# Altium schematic sheet MCU.SchDoc
size A3; SheetNumber: 2; SheetTotal: 4
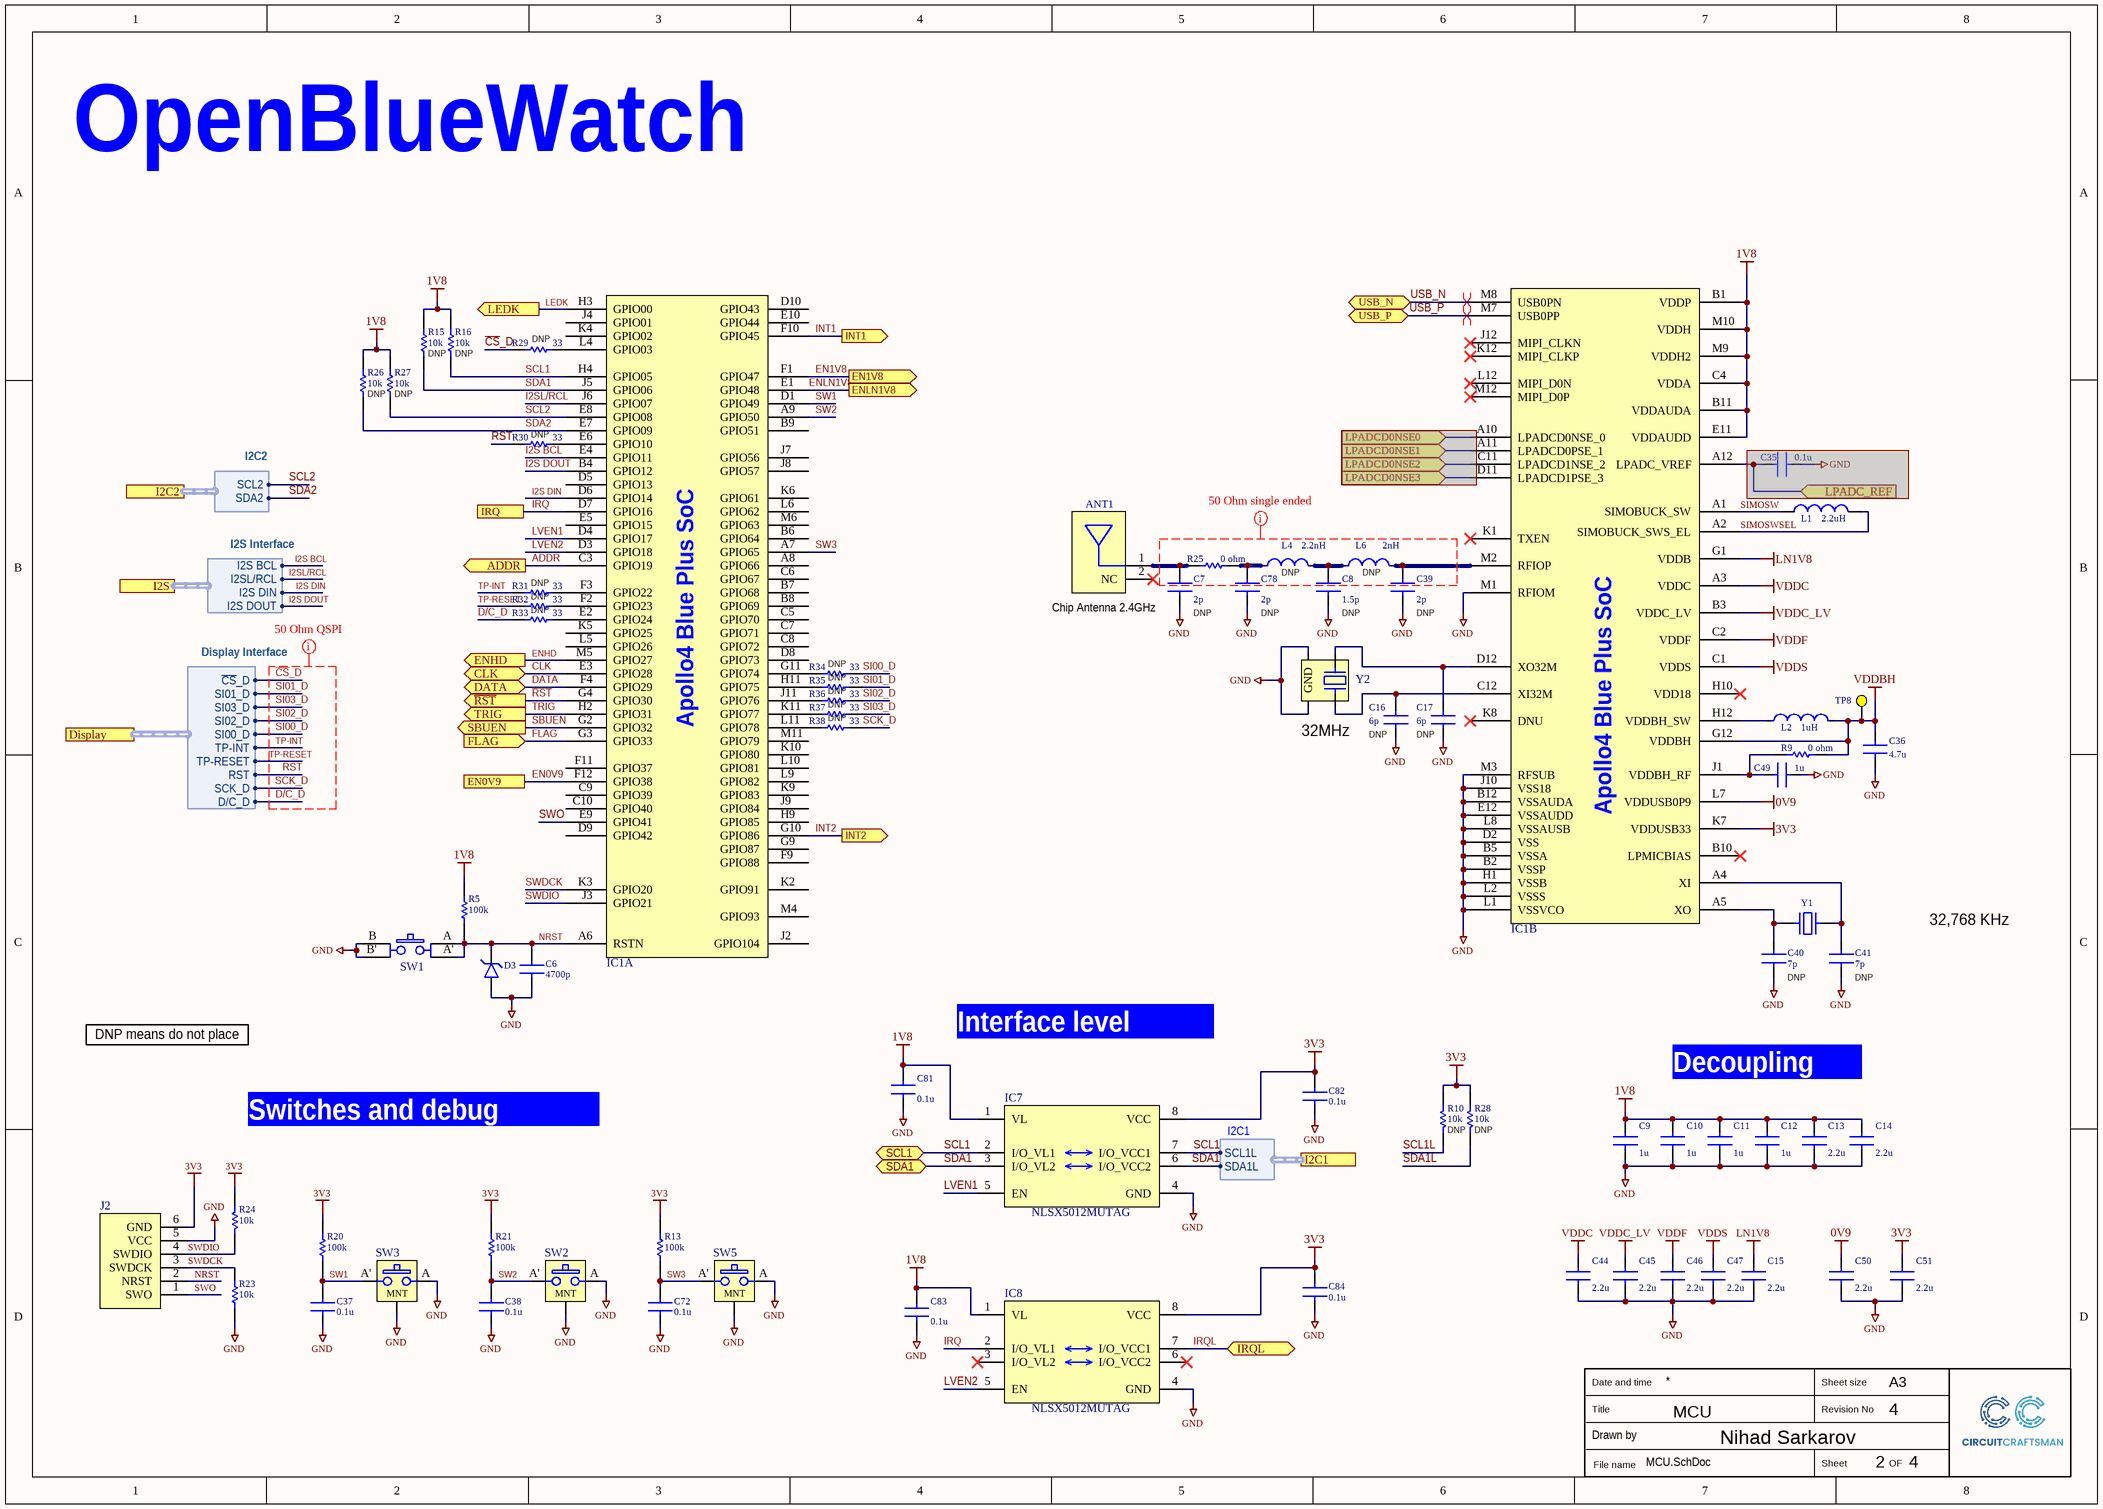
[diagram p0: MCU.SchDoc]

## Parts
ANT1  2450AT18A0100001E  [FP-2450AT18A0100001E-MFG]  (value not drawn)
C6  value 4700p  [FP-CC0201-BA-MFG]  (hidden comment: CC0201KRX7R8BB102)
C7  Capacitance: 2p  [FP-CC0201-BA-MFG]  (hidden comment: CC0201KRX7R8BB102)
C8  Capacitance: 1.5p  [FP-CC0201-BA-MFG]  (hidden comment: CC0201KRX7R8BB102)
C9  value 1u  [FP-CC0402-IPC_C]  (hidden comment: CC0402KRX7R7BB104)
C10  value 1u  [FP-CC0402-IPC_C]  (hidden comment: CC0402KRX7R7BB104)
C11  value 1u  [FP-CC0402-IPC_C]  (hidden comment: CC0402KRX7R7BB104)
C12  value 1u  [FP-CC0402-IPC_C]  (hidden comment: CC0402KRX7R7BB104)
C13  value 2.2u  [FP-CC0402-IPC_C]  (hidden comment: CC0402KRX7R7BB104)
C14  value 2.2u  [FP-CC0402-IPC_C]  (hidden comment: CC0402KRX7R7BB104)
C15  value 2.2u  [FP-CC0402-IPC_C]  (hidden comment: CC0402KRX7R7BB104)
C16  value 6p  [FP-CC0201-BA-MFG]  (hidden comment: CC0201KRX7R8BB102)
C17  value 6p  [FP-CC0201-BA-MFG]  (hidden comment: CC0201KRX7R8BB102)
C35  value 0.1u  [FP-CC0201-BA-MFG]  (hidden comment: CC0201KRX7R8BB102)  (masked out: inside a compile mask, not in the netlist)
C36  value 4.7u  [FP-CC0402-IPC_C]  (hidden comment: CC0402KRX7R7BB104)
C37  value 0.1u  [FP-CC0201-BA-MFG]  (hidden comment: CC0201KRX7R8BB102)
C38  value 0.1u  [FP-CC0201-BA-MFG]  (hidden comment: CC0201KRX7R8BB102)
C39  Capacitance: 2p  [FP-CC0201-BA-MFG]  (hidden comment: CC0201KRX7R8BB102)
C40  value 7p  [FP-CC0201-BA-MFG]  (hidden comment: CC0201KRX7R8BB102)
C41  value 7p  [FP-CC0201-BA-MFG]  (hidden comment: CC0201KRX7R8BB102)
C44  value 2.2u  [FP-CC0402-IPC_C]  (hidden comment: CC0402KRX7R7BB104)
C45  value 2.2u  [FP-CC0402-IPC_C]  (hidden comment: CC0402KRX7R7BB104)
C46  value 2.2u  [FP-CC0402-IPC_C]  (hidden comment: CC0402KRX7R7BB104)
C47  value 2.2u  [FP-CC0402-IPC_C]  (hidden comment: CC0402KRX7R7BB104)
C49  value 1u  [FP-CC0402-IPC_C]  (hidden comment: CC0402KRX7R7BB104)
C50  value 2.2u  [FP-CC0402-IPC_C]  (hidden comment: CC0402KRX7R7BB104)
C51  value 2.2u  [FP-CC0402-IPC_C]  (hidden comment: CC0402KRX7R7BB104)
C72  value 0.1u  [FP-CC0201-BA-MFG]  (hidden comment: CC0201KRX7R8BB102)
C78  Capacitance: 2p  [FP-CC0201-BA-MFG]  (hidden comment: CC0201KRX7R8BB102)
C81  value 0.1u  [FP-CC0201-BA-MFG]  (hidden comment: CC0201KRX7R8BB102)
C82  value 0.1u  [FP-CC0201-BA-MFG]  (hidden comment: CC0201KRX7R8BB102)
C83  value 0.1u  [FP-CC0201-BA-MFG]  (hidden comment: CC0201KRX7R8BB102)
C84  value 0.1u  [FP-CC0201-BA-MFG]  (hidden comment: CC0201KRX7R8BB102)
D3  PESD5V0X1UB,135  [SOD523]  (value not drawn)
IC1  AMA4B2KP-KXR  [BGA131C35P12X12_470X470X90]  (value not drawn)  (parts A,B of 2)
IC7  NLSX5012MUTAG  [NLSX5012MUTAG]
IC8  NLSX5012MUTAG  [NLSX5012MUTAG]
J2  8.06.16_J-LINK_6-PIN_NEEDLE_ADAPTER  [SEGGER_8.06.16_J-LINK_6-PIN_NEEDLE_ADAPTER]  (value not drawn)
L1  value 2.2uH  [INDC1608X100N]  (hidden comment: MBKK1608T2R2M)
L2  Inductance: 1uH  [FP-DFE18SAN_E0-IPC_A]  (hidden comment: DFE18SAN1R0ME0L)
L4  Inductance: 2.2nH  [FP-LQW15AN_00-W0_6-0_1-MFG]  (hidden comment: LQW15AN3N9B00D)
L6  Inductance: 2nH  [FP-LQW15AN_00-W0_6-0_1-MFG]  (hidden comment: LQW15AN3N9B00D)
R5  Resistance: 100k  [RESC0603X28X15LL5T05]  (hidden comment: CRCW02010000Z0ED)
R9  Resistance: 0 ohm  [RESC0603X28X15LL5T05]  (hidden comment: CRCW02010000Z0ED)
R10  Resistance: 10k  [RESC0603X28X15LL5T05]  (hidden comment: CRCW02010000Z0ED)
R13  Resistance: 100k  [RESC0603X28X15LL5T05]  (hidden comment: CRCW02010000Z0ED)
R15  Resistance: 10k  [RESC0603X28X15LL5T05]  (hidden comment: CRCW02010000Z0ED)
R16  Resistance: 10k  [RESC0603X28X15LL5T05]  (hidden comment: CRCW02010000Z0ED)
R20  Resistance: 100k  [RESC0603X28X15LL5T05]  (hidden comment: CRCW02010000Z0ED)
R21  Resistance: 100k  [RESC0603X28X15LL5T05]  (hidden comment: CRCW02010000Z0ED)
R23  Resistance: 10k  [RESC0603X28X15LL5T05]  (hidden comment: CRCW02010000Z0ED)
R24  Resistance: 10k  [RESC0603X28X15LL5T05]  (hidden comment: CRCW02010000Z0ED)
R25  Resistance: 0 ohm  [RESC0603X28X15LL5T05]  (hidden comment: CRCW02010000Z0ED)
R26  Resistance: 10k  [RESC0603X28X15LL5T05]  (hidden comment: CRCW02010000Z0ED)
R27  Resistance: 10k  [RESC0603X28X15LL5T05]  (hidden comment: CRCW02010000Z0ED)
R28  Resistance: 10k  [RESC0603X28X15LL5T05]  (hidden comment: CRCW02010000Z0ED)
R29  Resistance: 33  [RESC0603X28X15LL5T05]  (hidden comment: CRCW02010000Z0ED)
R30  Resistance: 33  [RESC0603X28X15LL5T05]  (hidden comment: CRCW02010000Z0ED)
R31  Resistance: 33  [RESC0603X28X15LL5T05]  (hidden comment: CRCW02010000Z0ED)
R32  Resistance: 33  [RESC0603X28X15LL5T05]  (hidden comment: CRCW02010000Z0ED)
R33  Resistance: 33  [RESC0603X28X15LL5T05]  (hidden comment: CRCW02010000Z0ED)
R34  Resistance: 33  [RESC0603X28X15LL5T05]  (hidden comment: CRCW02010000Z0ED)
R35  Resistance: 33  [RESC0603X28X15LL5T05]  (hidden comment: CRCW02010000Z0ED)
R36  Resistance: 33  [RESC0603X28X15LL5T05]  (hidden comment: CRCW02010000Z0ED)
R37  Resistance: 33  [RESC0603X28X15LL5T05]  (hidden comment: CRCW02010000Z0ED)
R38  Resistance: 33  [RESC0603X28X15LL5T05]  (hidden comment: CRCW02010000Z0ED)
SW1  EVP-BB2A9B000  [FP-EVP-BB2A9B000-MFG]  (value not drawn)
SW2  EVP-AKE31A  [FP-EVP-AKE31A-MFG]  (value not drawn)
SW3  EVP-AKE31A  [FP-EVP-AKE31A-MFG]  (value not drawn)
SW5  EVP-AKE31A  [FP-EVP-AKE31A-MFG]  (value not drawn)
TP8  Test point  [Test point]  (value not drawn)
Y1  ABS06-32.768KHZ-1-T  [FP-ABS06-MFG]  (value not drawn)
Y2  CX2016DB32000D0WZRC1  [CX2016DB32000D0WZRC1]  (value not drawn)

## Ports
ADDR (out, see Sensors and display[3D]), CLK (bidir, see Sensors and display[7D]), DATA (bidir, see Sensors and display[7D]), Display (harness Display Interface, see Sensors and display[1B]), EN0V9 (out, see Power[6C]), EN1V8 (out, see Power[6B]), ENHD (out, see Sensors and display[6C]), ENLN1V8 (out, see Power[7C]), FLAG (in, see Power[2B]), I2C1 (harness I2C1, see Sensors and display[1B]), I2C2 (harness I2C2, see Sensors and display[1B]), I2S (harness I2S Interface, see Sensors and display[1D]), INT1 (out, see Sensors and display[7B]), INT2 (out, see Sensors and display[7B]), IRQ, IRQL (bidir, see Power[4C]), LEDK (out, see Sensors and display[2C]), LPADC_REF (in), LPADCD0NSE0 (in), LPADCD0NSE1 (in), LPADCD0NSE2 (in), LPADCD0NSE3 (in), SBUEN (out, see Power[1B]), SCL1 (bidir, see Power[4C]), SDA1 (bidir, see Power[4C]), TRIG (out, see Sensors and display[7C]), USB_N (bidir, see Power[3C]), USB_P (bidir, see Power[3C]), ~{RST} (out, see Sensors and display[1D])

## Harnesses
I2S Interface: I2S BCL, I2SL/RCL, I2S DIN, I2S DOUT
Display Interface: ~{CS}_D, SI01_D, SI03_D, SI02_D, SI00_D, TP-INT, TP-RESET, RST, SCK_D, D/C_D
I2C1: SCL1L, SDA1L
I2C2: SCL2, SDA2

## Nets
0V9: C50.1 IC1.L7(VDDUSB0P9)
1V8: C9.1 C10.1 C11.1 C12.1 C13.1 C14.1 C81.1 C83.1 IC1.B1(VDDP) IC1.B11(VDDAUDA) IC1.C4(VDDA) IC1.E11(VDDAUDD) IC1.M9(VDDH2) IC1.M10(VDDH) IC7.1(VL) IC8.1(VL) R5.1 R15.1 R16.1 R26.1 R27.1
3V3: C51.1 C82.1 C84.1 IC1.K7(VDDUSB33) IC7.8(VCC) IC8.8(VCC) J2.6(GND) R10.1 R13.1 R20.1 R21.1 R24.1 R28.1
GND: C6.1 C7.2 C8.2 C9.2 C10.2 C11.2 C12.2 C13.2 C14.2 C15.2 C16.1 C17.1 C36.2 C37.1 C38.1 C39.2 C40.2 C41.2 C44.2 C45.2 C46.2 C47.2 C49.2 C50.2 C51.2 C72.1 C78.2 C81.2 C82.2 C83.2 C84.2 D3.2(A) IC1.B2(VSSP) IC1.B5(VSSA) IC1.B12(VSSAUDA) IC1.D2(VSS) IC1.E12(VSSAUDD) IC1.H1(VSSB) IC1.J10(VSS18) IC1.L1(VSSVCO) IC1.L2(VSSS) IC1.L8(VSSAUSB) IC1.M1(RFIOM) IC1.M3(RFSUB) IC7.4(GND) IC8.4(GND) J2.5(VCC) R23.2 SW1.B SW1.B' SW2.1(MNT) SW2.A SW3.1(MNT) SW3.A SW5.1(MNT) SW5.A Y2.2(GND) Y2.4(GND)
LN1V8: C15.1 IC1.G1(VDDB)
VDDBH: C36.1 IC1.G12(VDDBH) L2.2 R9.1 TP8.1
VDDC: C44.1 IC1.A3(VDDC)
VDDC_LV: C45.1 IC1.B3(VDDC_LV)
VDDF: C46.1 IC1.C2(VDDF)
VDDS: C47.1 IC1.C1(VDDS)
ADDR: IC1.C3(GPIO19) ; port ADDR
~{CS}_D: R29.1 ; port Display.~{CS}_D
CLK: IC1.E3(GPIO28) ; port CLK
D/C_D: R33.1 ; port Display.D/C_D
DATA: IC1.F4(GPIO29) ; port DATA
EN0V9: IC1.F12(GPIO38)
EN1V8: IC1.F1(GPIO47) ; port EN1V8
ENHD: IC1.M5(GPIO27) ; port ENHD
ENLN1V8: IC1.E1(GPIO48) ; port ENLN1V8
FLAG: IC1.G3(GPIO33) ; port FLAG
I2S BCL: IC1.E4(GPIO11) ; port I2S.I2S BCL
I2S DIN: IC1.D6(GPIO14) ; port I2S.I2S DIN
I2S DOUT: IC1.B4(GPIO12) ; port I2S.I2S DOUT
I2SL/RCL: IC1.J6(GPIO07) ; port I2S.I2SL/RCL
INT1: IC1.F10(GPIO45) ; port INT1
INT2: IC1.G10(GPIO86) ; port INT2
IRQ: IC1.D7(GPIO16) IC8.2(I/O_VL1) ; port IRQ
IRQL: IC8.7(I/O_VCC1) ; port IRQL
LEDK: IC1.H3(GPIO00) ; port LEDK
LVEN1: IC1.D4(GPIO17) IC7.5(EN)
LVEN2: IC1.D3(GPIO18) IC8.5(EN)
NRST: C6.2 D3.1(K) IC1.A6(RSTN) J2.2(NRST) R5.2 SW1.A SW1.A'
~{RST}: IC1.G4(GPIO30) ; port ~{RST}
RST: R30.1 ; port Display.RST
SBUEN: IC1.G2(GPIO32) ; port SBUEN
SCK_D: R38.2 ; port Display.SCK_D
SCL1: IC1.H4(GPIO05) IC7.2(I/O_VL1) R16.2 ; port SCL1
SCL1L: IC7.7(I/O_VCC1) R10.2 ; port I2C1.SCL1L
SCL2: IC1.E8(GPIO08) R27.2 ; port I2C2.SCL2
SDA1: IC1.J5(GPIO06) IC7.3(I/O_VL2) R15.2 ; port SDA1
SDA1L: IC7.6(I/O_VCC2) R28.2 ; port I2C1.SDA1L
SDA2: IC1.E7(GPIO09) R26.2 ; port I2C2.SDA2
SI00_D: R34.2 ; port Display.SI00_D
SI01_D: R35.2 ; port Display.SI01_D
SI02_D: R36.2 ; port Display.SI02_D
SI03_D: R37.2 ; port Display.SI03_D
SIMOSW: IC1.A1(SIMOBUCK_SW) L1.2
SIMOSWSEL: IC1.A2(SIMOBUCK_SWS_EL) L1.1
SW1: C37.2 IC1.D1(GPIO49) R20.2 SW3.A'
SW2: C38.2 IC1.A9(GPIO50) R21.2 SW2.A'
SW3: C72.2 IC1.A7(GPIO65) R13.2 SW5.A'
SWDCK: IC1.K3(GPIO20) J2.3(SWDCK) R23.1
SWDIO: IC1.J3(GPIO21) J2.4(SWDIO) R24.2
SWO: IC1.E9(GPIO41) J2.1(SWO)
TP-INT: R31.1 ; port Display.TP-INT
TP-RESET: R32.1 ; port Display.TP-RESET
TRIG: IC1.H2(GPIO31) ; port TRIG
USB_N: IC1.M8(USB0PN) ; port USB_N
USB_P: IC1.M7(USB0PP) ; port USB_P
NetANT1_1: ANT1.1(FEED) C7.1 R25.2
NetC8_1: C8.1 L4.2 L6.1
NetC16_2: C16.2 IC1.C12(XI32M) Y2.1
NetC17_2: C17.2 IC1.D12(XO32M) Y2.3
NetC39_1: C39.1 IC1.M2(RFIOP) L6.2
NetC40_1: C40.1 IC1.A5(XO) Y1.1
NetC41_1: C41.1 IC1.A4(XI) Y1.2
NetC49_1: C49.1 IC1.J1(VDDBH_RF) R9.2
NetC78_1: C78.1 L4.1 R25.1
NetIC1_E2: IC1.E2(GPIO24) R33.2
NetIC1_E6: IC1.E6(GPIO10) R30.2
NetIC1_F2: IC1.F2(GPIO23) R32.2
NetIC1_F3: IC1.F3(GPIO22) R31.2
NetIC1_G11: IC1.G11(GPIO74) R34.1
NetIC1_H11: IC1.H11(GPIO75) R35.1
NetIC1_H12: IC1.H12(VDDBH_SW) L2.1
NetIC1_J11: IC1.J11(GPIO76) R36.1
NetIC1_K11: IC1.K11(GPIO77) R37.1
NetIC1_L4: IC1.L4(GPIO03) R29.2
NetIC1_L11: IC1.L11(GPIO78) R38.1

Not connected (* = marked no-connect by the designer): ANT1 2(NC)*; IC1 A8(GPIO66) A10(LPADCD0NSE_0) A11(LPADCD0PSE_1) A12(LPADC_VREF) B6(GPIO64) B7(GPIO68) B8(GPIO69) B9(GPIO51) B10(LPMICBIAS)* C5(GPIO70) C6(GPIO67) C7(GPIO71) C8(GPIO72) C9(GPIO39) C10(GPIO40) C11(LPADCD1NSE_2) D5(GPIO13) D8(GPIO73) D9(GPIO42) D10(GPIO43) D11(LPADCD1PSE_3) E5(GPIO15) E10(GPIO44) F9(GPIO88) F11(GPIO37) G9(GPIO87) H9(GPIO85) H10(VDD18)* J2(GPIO104) J4(GPIO01) J7(GPIO56) J8(GPIO57) J9(GPIO84) J12(MIPI_CLKN)* K1(TXEN)* K2(GPIO91) K4(GPIO02) K5(GPIO25) K6(GPIO61) K8(DNU)* K9(GPIO83) K10(GPIO80) K12(MIPI_CLKP)* L5(GPIO26) L6(GPIO62) L9(GPIO82) L10(GPIO81) L12(MIPI_D0N)* M4(GPIO93) M6(GPIO63) M11(GPIO79) M12(MIPI_D0P)*; IC8 3(I/O_VL2)* 6(I/O_VCC2)*

## Layout directives
mark named 50 Ohm single ended: (no net found under the mark)
differential pair; differential pair class 90USB: USB_N, USB_P
mark named 50 Ohm QSPI: D/C_D, RST, SCK_D, SI00_D, SI01_D, SI02_D, SI03_D, TP-INT, TP-RESET, ~{CS}_D

## Notes on the sheet
- OpenBlueWatch
- DNP
- (near R16) DNP
- (near R29) DNP
- (near R27) DNP
- (near R30) DNP
- (near R31) DNP
- (near L4) DNP
- (near L6) DNP
- (near C7) Chip Antenna 2.4GHz
- (near C7) DNP
- (near C78) DNP
- (near C8) DNP
- (near C39) DNP
- (near R34) DNP
- (near Y2) 32MHz
- (near C16) DNP
- (near C40) DNP
- (near C41) DNP
- 32,768 KHz
- DNP means do not place
- Interface level shifters
- Switches and debug connector
- Decoupling caps
- (near R28) DNP
- MCU
- 4
- 2
- Date and time
- Sheet size
- A3
- Title
- Drawn by
- File name
- Nihad Sarkarov
- Sheet
- Revision No
- OF
- (in symbol AMA4B2KP-KXR, part A) Apollo4 Blue Plus SoC
- (in symbol AMA4B2KP-KXR, part B) Apollo4 Blue Plus SoC

## Library data of the parts
ANT1 = CMP-00849-122784405-1: 2450AT18A0100001E Antenna Chip 2.4GHZ Miniature; NexarPartId: 122784405; Supplier 1: Digikey; Supplier Part Number 1: 712-2450AT18A0100001ECT-ND
C6 C16 C17 C35 C37 C38 C72 C81-C84 = CMP-03422-000456-1: CAP CER X7R 0201; Manufacturer: Yageo; Temperature Coefficient: 15%; Tolerance: 0.1; Voltage Rating: 25 V; Material: Ceramic; Footprint Url: http://www.yageo.com/exep/pages/download/literatures/UPY-C_GEN_24.pdf; Digikey Description: CAP CER 1000PF 25V X7R 0201; ComponentLink2URL: http://www.yageo.com/documents/recent/UPY-GPHC_X5R_4V-to-50V_25.pdf; Manufacturer Part Number: CC0201KRX7R8BB102; Lead Free: Yes; Temperature: -55°C to +85°C; Package: CC0201-BA; Automotive: No; Device Class L1: Passive Components; ComponentLink2Description: Datasheet; Octopart: https://octopart.com/cc0201krx7r8bb102-yageo-9292631; Temperature Range High: +85°C; Device Class L3: Ceramic Capacitors; Temperature Range Low: -55°C; Category: Cap; Device Class L2: Capacitors; Ipc Land Pattern Name: CAPC6030X30; Height: 0.33mm; Temperature Characteristic: X7R; RoHS: TRUE; Mouser Description: Multilayer Ceramic Capacitors MLCC - SMD/SMT 1.0nF 25V X7R 10%
  C6: Capacitance: 4700p
  C16 C17: Capacitance: 6p
  C35 C37 C38 C72 C81-C84: Capacitance: 0.1u
C7 C39 C78 = CMP-03422-000456-1: CAP CER X7R 0201; Manufacturer: Yageo; Temperature Coefficient: 15%; Tolerance: 0.1; Voltage Rating: 25 V; Material: Ceramic; Value: 2p; Footprint Url: http://www.yageo.com/exep/pages/download/literatures/UPY-C_GEN_24.pdf; Digikey Description: CAP CER 1000PF 25V X7R 0201; ComponentLink2URL: http://www.yageo.com/documents/recent/UPY-GPHC_X5R_4V-to-50V_25.pdf; Manufacturer Part Number: CC0201KRX7R8BB102; Lead Free: Yes; Temperature: -55°C to +85°C; Package: CC0201-BA; Automotive: No; Device Class L1: Passive Components; ComponentLink2Description: Datasheet; Octopart: https://octopart.com/cc0201krx7r8bb102-yageo-9292631; Temperature Range High: +85°C; Device Class L3: Ceramic Capacitors; Temperature Range Low: -55°C; Category: Cap; Device Class L2: Capacitors; Ipc Land Pattern Name: CAPC6030X30; Height: 0.33mm; Temperature Characteristic: X7R; RoHS: TRUE; Mouser Description: Multilayer Ceramic Capacitors MLCC - SMD/SMT 1.0nF 25V X7R 10%
C8 = CMP-03422-000456-1: CAP CER X7R 0201; Manufacturer: Yageo; Temperature Coefficient: 15%; Tolerance: 0.1; Voltage Rating: 25 V; Material: Ceramic; Value: 1.5p; Footprint Url: http://www.yageo.com/exep/pages/download/literatures/UPY-C_GEN_24.pdf; Digikey Description: CAP CER 1000PF 25V X7R 0201; ComponentLink2URL: http://www.yageo.com/documents/recent/UPY-GPHC_X5R_4V-to-50V_25.pdf; Manufacturer Part Number: CC0201KRX7R8BB102; Lead Free: Yes; Temperature: -55°C to +85°C; Package: CC0201-BA; Automotive: No; Device Class L1: Passive Components; ComponentLink2Description: Datasheet; Octopart: https://octopart.com/cc0201krx7r8bb102-yageo-9292631; Temperature Range High: +85°C; Device Class L3: Ceramic Capacitors; Temperature Range Low: -55°C; Category: Cap; Device Class L2: Capacitors; Ipc Land Pattern Name: CAPC6030X30; Height: 0.33mm; Temperature Characteristic: X7R; RoHS: TRUE; Mouser Description: Multilayer Ceramic Capacitors MLCC - SMD/SMT 1.0nF 25V X7R 10%
C9-C15 C36 C44-C47 C49-C51 = CMP-03422-000048-1: CAP CER  X7R 0402; Manufacturer: YAGEO; Material: Ceramic; Automotive Grade: NA; Temperature Coefficient: 30ppm/°C; Voltage Rating: 16 V; Tolerance: 0.1; Device Class L1: Passive Components; Temperature Range Low: -55°C; Device Class L3: Ceramic Capacitors; Temperature Characteristic: X7R; Ipc Land Pattern Name: CAPC10050X50; Temperature Range High: +125°C; Temperature: -55°C to +125°C; RoHS: TRUE; Automotive: No; Height: 0.55mm; Device Class L2: Capacitors; Digikey Description: CAP CER 0.1UF 16V X7R 0402; Package: CC0402; Footprint Url: http://www.yageo.com/exep/pages/download/literatures/UPY-C_GEN_24.pdf; ComponentLink2Description: Datasheet; Category: Cap; Lead Free: Yes; Octopart: https://octopart.com/cc0402krx7r7bb104-yageo-42244624; ComponentLink2URL: http://www.yageo.com/documents/recent/UPY-GP_NP0_16V-to-50V_16.pdf; Manufacturer Part Number: CC0402KRX7R7BB104; Mouser Description: 0402 0.1 uF 16 V ±10 % Tolerance X7R SMT Multilayer Ceramic Capacitor
  C9-C12 C49: Capacitance: 1u
  C13-C15 C44-C47 C50 C51: Capacitance: 2.2u
  C36: Capacitance: 4.7u
C40 C41 = CMP-03422-000456-1: CAP CER X7R 0201; Manufacturer: Yageo; Temperature Coefficient: 15%; Tolerance: 0.1; Voltage Rating: 25 V; Material: Ceramic; Capacitance: 15p; Footprint Url: http://www.yageo.com/exep/pages/download/literatures/UPY-C_GEN_24.pdf; Digikey Description: CAP CER 1000PF 25V X7R 0201; ComponentLink2URL: http://www.yageo.com/documents/recent/UPY-GPHC_X5R_4V-to-50V_25.pdf; Manufacturer Part Number: CC0201KRX7R8BB102; Lead Free: Yes; Temperature: -55°C to +85°C; Package: CC0201-BA; Automotive: No; Device Class L1: Passive Components; ComponentLink2Description: Datasheet; Octopart: https://octopart.com/cc0201krx7r8bb102-yageo-9292631; Temperature Range High: +85°C; Device Class L3: Ceramic Capacitors; Temperature Range Low: -55°C; Category: Cap; Device Class L2: Capacitors; Ipc Land Pattern Name: CAPC6030X30; Height: 0.33mm; Temperature Characteristic: X7R; RoHS: TRUE; Mouser Description: Multilayer Ceramic Capacitors MLCC - SMD/SMT 1.0nF 25V X7R 10%
D3 = PESD5V0X1UB,135: Ultra low capacitance unidirectional ElectroStatic Discharge (ESD) protection diode in a  SOD523 (SC-79) ultra small and flat lead Surface-Mounted Device (SMD) plastic  package designed to protect one signal line from the damage caused by ESD and other  transients.<p> <author>AAL Eindhoven MK</author><hr><p> <img src=http://www.nxp.com/img/NXP_logo.png>; MF: {'manufacturer': u'Nexperia USA'}; Package: None; Price: None; Value: *; MP: PESD5V0X1UB,135; Availability: Unavailable
IC1 = AMA4B2KP-KXR: ARM® Cortex®-M4F System On Chip (SOC) IC Apollo4 Blue Plus 192MHz 131-BGA (4.7x4.7); Manufacturer_Name: Ambiq Micro; Datasheet Link: https://ambiq.com/wp-content/uploads/2022/05/Apollo4-Blue-Plus-SoC-Datasheet.pdf; Height: 0.9mm; Manufacturer_Part_Number: AMA4B2KP-KXR; Mouser Part Number: 222-AMA4B2KP-KXR; Mouser Price/Stock: https://www.mouser.co.uk/ProductDetail/Ambiq/AMA4B2KP-KXR?qs=Imq1NPwxi759ZYSiMDc3RQ%3D%3D; Supplier 1: Digikey; Supplier Part Number 1: 5128-AMA4B2KP-KXRCT-ND
IC7 IC8 = NLSX5012MUTAG: Voltage Level Translator Bidirectional 1 Circuit 2 Channel 100Mbps 8-UDFN (1.8x1.2); Manufacturer_Name: onsemi; Datasheet Link: https://www.onsemi.com/download/data-sheet/pdf/NLSX5012-D.PDF; Height: 0.55mm; Manufacturer_Part_Number: NLSX5012MUTAG; Mouser Part Number: 863-NLSX5012MUTAG; Mouser Price/Stock: https://www.mouser.com/Search/Refine.aspx?Keyword=863-NLSX5012MUTAG; Supplier 1: Avnet; Supplier Part Number 1: NLSX5012MUTAG
J2 = 8.06.16_J-LINK_6-PIN_NEEDLE_ADAPTER: J-LINK 6-PIN NEEDLE ADAPTER; MF: {'manufacturer': u'Segger Microcontroller'}; Package: None; Price: None; Value: *; MP: 8.06.16_J-LINK_6-PIN_NEEDLE_ADAPTER; Availability: Unavailable
L1 = MBKK1608T2R2M: Ind Power Wirewound 2.2uH 20% 1MHz Metal 520mA 0603 Embossed T/R; MF: {'manufacturer': u'Taiyo Yuden'}; Package: 0603; Price: None; MP: MBKK1608T2R2M; Availability: Unavailable
L2 = CMP-06042-016331-1: FIXED IND 1UH 1.6A 144 MOHM SMD; Saturation Current: 2A; DC Resistance (DCR): 144mR; Shielding: Shielded; Core Material: Metal; Tolerance: 20%; Test Frequency: 1MHz; Mount: Surface Mount; Min Operating Temperature: -40°C; Current Rating: 1.6A; Case Code (Imperial): 0603; RoHS Compliant: Yes; Max Operating Temperature: 85°C; Case/Package: 0603; Packaging: Cut Tape; Case Code (Metric): 1608
L4 L6 = CMP-06042-000827-1: Wire Wound RF Inductor 3.9nH ±0.1nH 750mA 0.07Ω 0402 (1005); Shielding: Unshielded; Self Resonant Frequency: 10GHz; Core Material: Air; Test Frequency: 100MHz; DC Resistance (DCR): 70mR; Length: 1mm; Height: 0.5mm; Case Code (Metric): 1005; Lead Free: Lead Free; Military Standard: Not; Mount: Surface Mount; Current: 750mA; REACH SVHC: No SVHC; Current Rating: 750mA; DC Current: 750mA; Max Operating Temperature: 125°C; Package Quantity: 10000; Packaging: Tape and Reel; Case/Package: 0402; Min Operating Temperature: -55°C; Width: 0.02inch; Depth: 0.7mm; Termination: SMD/SMT; Weight: 2.8E-05oz; Number of Pins: 2; Radiation Hardening: No; Max DC Current: 750mA; Case Code (Imperial): 0402
R5 R9 R10 R13 R15 R16 R20 R21 R23-R38 = CMP-2004-00001-2: Chip Resistor, 0 Ohm, 0.05 W, -55 to 155 degC, 0201 (0603 Metric), RoHS, Tape and Reel; Voltage Rating: 30 V; Case\Package: 0201; Tolerance: 5%; Power Rating: 50 mW; REACH SVHC: Unknown; Length: 0.6 mm; Packaging: Cut Tape; Weight: 6E-06 oz; ComponentLink2URL: http://www.vishay.com/docs/20052/crcw0201e3.pdf; Mounting Technology: Surface Mount; Case Code (Imperial): 0201; Radiation Hardening: No; RoHSCompliant: true; Package Quantity: 1; Min Operating Temperature: -55 degC; Height: 0.23 mm; PackageReference: 0201; ComponentLink1Description: Manufacturer URL; ComponentLink2Description: Datasheet; Case Code (Metric): 0603; DatasheetVersion: 03/2016; Width: 0.3 mm; Mount: Surface Mount; PackageDescription: 2-Pin Surface Mount Device, Body 0.6 x 0.3 mm; ComponentLink1URL: http://www.vishay.com/; Max Operating Temperature: 155 degC
SW1 = CMP-05618-000013-1: SWITCH TACTILE SPST-NO 0.02A 15V; Manufacturer: Panasonic; Electromechanical Life: 500000Cycles; Contact Resistance: 500mΩ; Operating Force: 1.6N; Standoff Height: 0.025mm; Contact Current Rating: 20mA; Automotive: No; Digikey Description: SWITCH TACTILE SPST-NO 0.02A 15V; Octopart: https://octopart.com/evp-bb2a9b000-panasonic-75477754; Lead Free: Yes; Device Class L2: Switches; Temperature Range Low: -40°C; Temperature: -40°C to +85°C; Mount: Surface Mount; Temperature Range High: +85°C; Throw Configuration: SPST-NO; Device Class L1: Electromechanical; Height: 0.63mm; Manufacturer Part Number: EVP-BB2A9B000; Package: 0; ComponentLink2Description: Datasheet; Category: Switch; RoHS: TRUE; ComponentLink2URL: https://www3.panasonic.biz/ac/e_download/control/switch/light-touch/catalog/sw_lt_eng_2616s.pdf?f_cd=402266&via=ok; Voltage Rating Dc: 15V; Device Class L3: Tactile Switches
SW2 SW3 SW5 = CMP-05618-000005-1: 3.8MM X 1.9MM / 1.6N / 0.12MM ST; Manufacturer: Panasonic; Electromechanical Life: 500000Cycles; Contact Resistance: 100mΩ; Contact Current Rating: 20mA; Throw Configuration: SPST-NO; Voltage Rating Dc: 15V; Manufacturer Part Number: EVP-AKE31A; Temperature Range High: +85°C; Mount: Surface Mount; Mouser Description: Switch Tactile N.O. SPST Rectangular Button Gull Wing 0.02A 15VDC 500000Cycles 1.6N SMD T/R; Digikey Description: 3.8MM X 1.9MM / 1.6N / 0.12MM ST; ComponentLink2URL: https://www3.panasonic.biz/ac/e_download/control/switch/light-touch/catalog/sw_lt_eng_3819s_side.pdf?f_cd=402908&via=ok; RoHS: TRUE; Temperature: -40°C to +85°C; Category: Switch; Device Class L3: Tactile Switches; Automotive: No; Lead Free: Yes; ComponentLink2Description: Datasheet; Temperature Range Low: -40°C; Octopart: https://octopart.com/evp-ake31a-panasonic-84742583; Operating Force: 1.6N; Package: 0; Device Class L2: Switches; Height: 1.68mm; Device Class L1: Electromechanical
TP8 = Test point: 1mm x 1mm round pad for testing purposes
Y1 = CMP-27762-012387-2: CRYSTAL 32.7680KHZ 12.5PF SMD; Series Resistance: 90kR; Frequency Tolerance: 10ppm; Number of Pins: 2; Max Operating Temperature: 85°C; Load Capacitance: 12.5pF; Series: ABS06; Depth: 1.2mm; Height: 0.6mm; Min Operating Temperature: -40°C; Mount: Surface Mount; Lead Free: Lead Free; Width: 1.2mm; Frequency: 32.768kHz; ESR (Equivalent Series Resistance): 90kR; Termination: SMD/SMT; Packaging: Tape and Reel; RoHS Compliant: Yes; REACH SVHC: No SVHC; Operating Frequency: 32.768 kHz; Case/Package: CSMD; Package Quantity: 3000; Radiation Hardening: No; Tolerance: 10ppm; Length: 2mm; Supplier 1: Mouser; Supplier Part Number 1: 815-ABS06-32.7K-1-T
Y2 = CX2016DB32000D0WZRC1: 32 MHz ±25ppm Crystal 8pF 60 Ohms 4-SMD, No Lead; Manufacturer_Name: Kyocera AVX; Datasheet Link: https://ele.kyocera.com/assets/products/crystal-device/cx2016db_e.pdf; Height: 0.45mm; Manufacturer_Part_Number: CX2016DB32000D0WZRC1; Mouser Part Number: 581-CX2016DB32DWZRC1; Mouser Price/Stock: https://www.mouser.co.uk/ProductDetail/KYOCERA-AVX/CX2016DB32000D0WZRC1?qs=mHG8nxlouK5LiZGb%2FcBxwg%3D%3D; Arrow Part Number: CX2016DB32000D0WZRC1; Arrow Price/Stock: https://www.arrow.com/en/products/cx2016db32000d0wzrc1/avx; Supplier 1: Digikey; Supplier Part Number 1: 478-CX2016DB32000D0WZRC1CT-ND